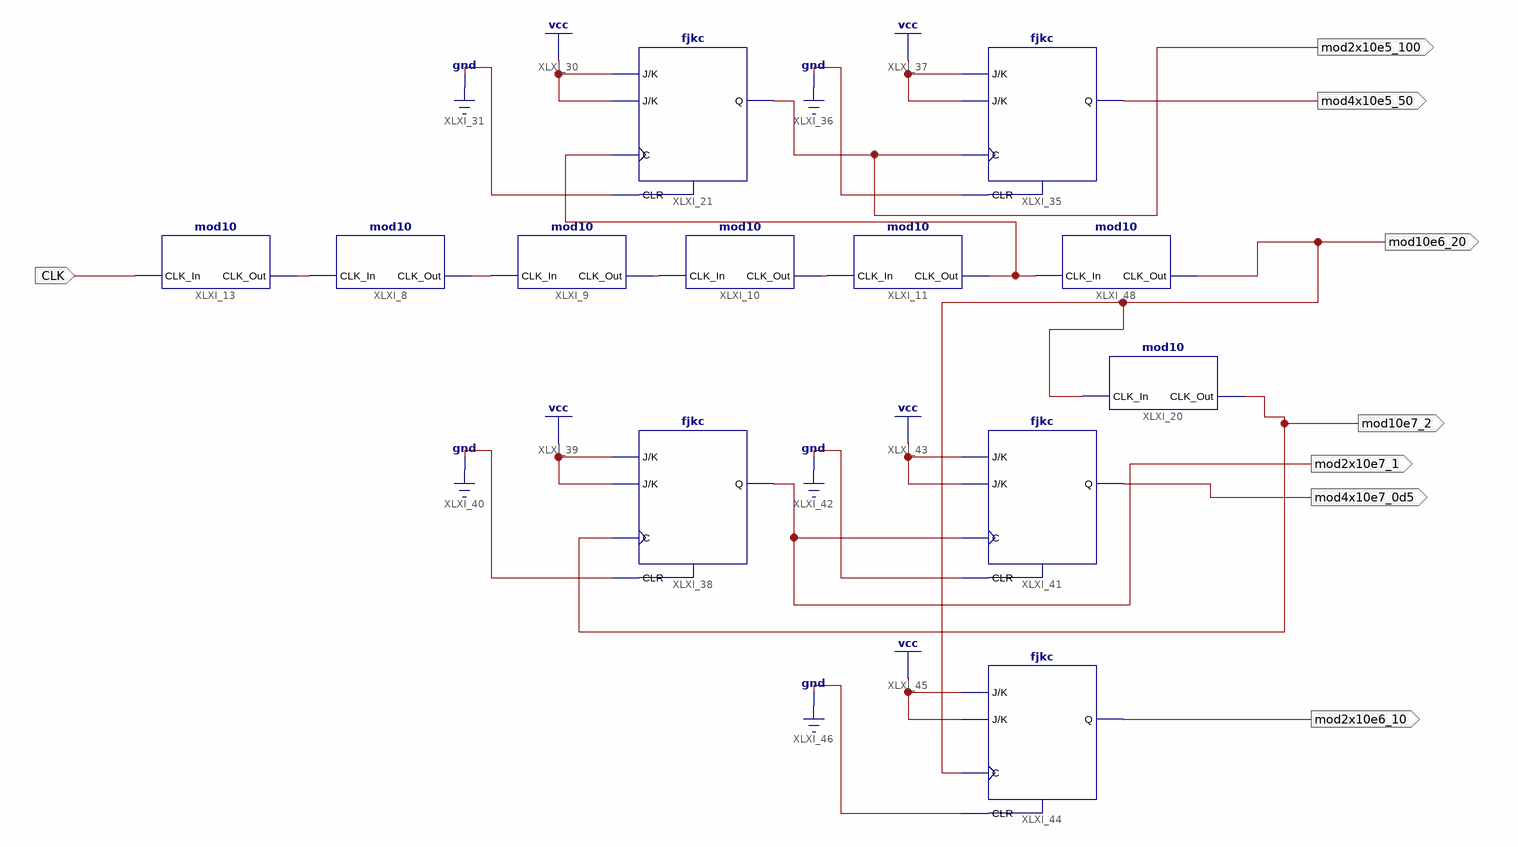
[diagram p0: schematic sheet 1]
// Xilinx ISE schematic ADJCLK.sch (spartan6) as structural Verilog: 12 symbols, 8 ports
module ADJCLK (
  input  CLK,
  output mod10e6_20,
  output mod10e7_2,
  output mod4x10e5_50,
  output mod2x10e5_100,
  output mod4x10e7_0d5,
  output mod2x10e7_1,
  output mod2x10e6_10
);

  wire XLXN_2, XLXN_3, XLXN_5, XLXN_20, XLXN_60;

  mod10 XLXI_9 (.CLK_In(XLXN_60), .CLK_Out(XLXN_2));
  mod10 XLXI_10 (.CLK_In(XLXN_2), .CLK_Out(XLXN_3));
  mod10 XLXI_20 (.CLK_In(mod10e6_20), .CLK_Out(mod10e7_2));
  fjkc XLXI_21 (.C(XLXN_20), .CLR(1'b0), .J(1'b1), .K(1'b1), .Q(mod2x10e5_100));
  fjkc XLXI_35 (.C(mod2x10e5_100), .CLR(1'b0), .J(1'b1), .K(1'b1), .Q(mod4x10e5_50));
  mod10 XLXI_11 (.CLK_In(XLXN_3), .CLK_Out(XLXN_20));
  mod10 XLXI_48 (.CLK_In(XLXN_20), .CLK_Out(mod10e6_20));
  mod10 XLXI_13 (.CLK_In(CLK), .CLK_Out(XLXN_5));
  mod10 XLXI_8 (.CLK_In(XLXN_5), .CLK_Out(XLXN_60));
  fjkc XLXI_38 (.C(mod10e7_2), .CLR(1'b0), .J(1'b1), .K(1'b1), .Q(mod2x10e7_1));
  fjkc XLXI_44 (.C(mod10e6_20), .CLR(1'b0), .J(1'b1), .K(1'b1), .Q(mod2x10e6_10));
  fjkc XLXI_41 (.C(mod2x10e7_1), .CLR(1'b0), .J(1'b1), .K(1'b1), .Q(mod4x10e7_0d5));
endmodule
